# EAGLE schematic mosfet-cs (EAGLE 9.6.1)
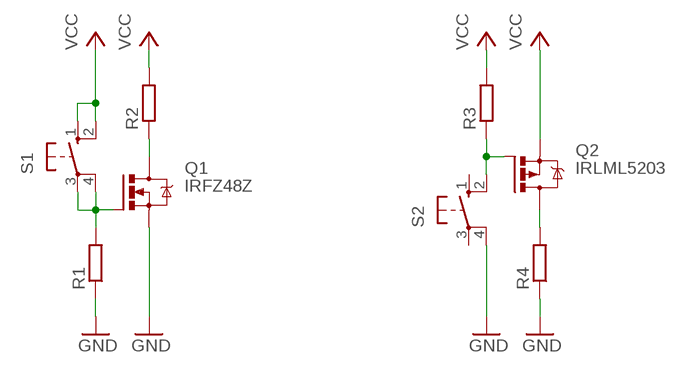
[diagram p0: schematic, sheet 1]

## Parts
Q1  IRFZ48Z  [TO220BH]
Q2  IRLML5203  [MICRO3]
R1  R-EU_0207/10  [0207/10]
R2  R-EU_0207/10  [0207/10]
R3  R-EU_0207/10  [0207/10]
R4  R-EU_0207/10  [0207/10]
S1  10-XX  [B3F-10XX]
S2  10-XX  [B3F-10XX]

## Nets
GND: Q1.S R1.1 R4.1 S2.4(P1)
N$1: Q1.D R2.1
N$2: Q1.G R1.2 S1.3(P) S1.4(P1)
N$3: Q2.1(G) R3.1 S2.2(S1)
N$4: Q2.3(D) R4.2
VCC: Q2.2(S) R2.2 R3.2 S1.1(S) S1.2(S1)
Unconnected: S2.1(S) S2.3(P)

## Library data of the parts
Q1 = transistor-power:IRFZ48: N Channel HEXFET® Power MOSFET Logic Level Source: http://www.irf.com/product-info/datasheets/data/irfz48z.pdf
Q2 = transistor-power:IRLML5203: HEXFET P-Channel Power MOSFET
R1-R4 = rcl:R-EU_: RESISTOR, European symbol; SPICEPREFIX: R
S1 S2 = switch-omron:10-XX: OMRON SWITCH; MPN: B3F-1000; OC_FARNELL: 176432; OC_NEWARK: 36M3542